# Altium project B5PLMF_ONLAB.PrjPCB
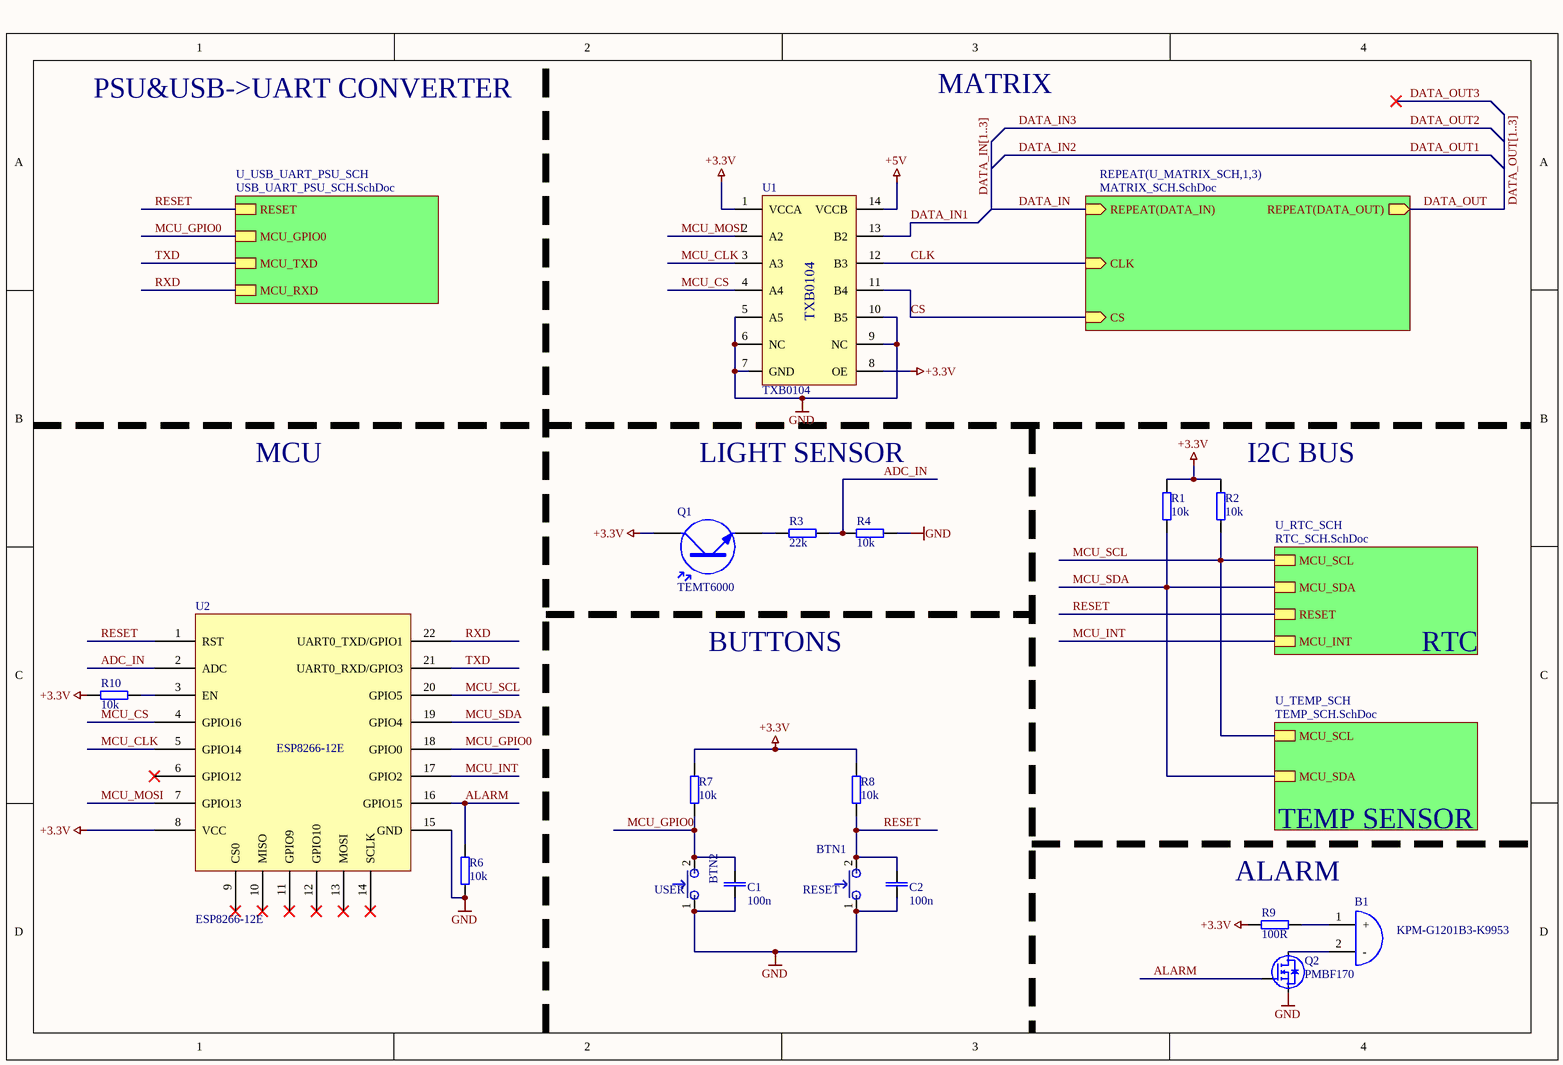
[diagram p0: MAIN_SCH.SchDoc]
5 sheets, 64 parts. Net scope: hierarchical (ports join the sheet entries above them; power ports are global).
Board file: B5PLMF_ONLAB.PcbDoc
Sheets:
  MAIN_SCH.SchDoc
    U_MATRIX_SCH1 = MATRIX_SCH.SchDoc
    U_MATRIX_SCH2 = MATRIX_SCH.SchDoc
    U_MATRIX_SCH3 = MATRIX_SCH.SchDoc
    U_RTC_SCH = RTC_SCH.SchDoc
    U_TEMP_SCH = TEMP_SCH.SchDoc
    U_USB_UART_PSU_SCH = USB_UART_PSU_SCH.SchDoc

## Sheet MAIN_SCH.SchDoc
size A4

### Parts
B1  KPM-G1201B3-K9953  [KPM-G1201B3-K9953]
BTN1  USER  [PBUTTON_SMD]
BTN2  RESET  [PBUTTON_SMD]
C1  100n  [CAP 0805]
C2  100n  [CAP 0805]
Q1  TEMT6000  [TEMT600]
Q2  PMBF170  [SOT23]
R1  10k  [RES 0805]
R2  10k  [RES 0805]
R3  22k  [RES 0805]
R4  10k  [RES 0805]
R6  10k  [RES 0805]
R7  10k  [RES 0805]
R8  10k  [RES 0805]
R9  100R  [RES 0805]
R10  10k  [RES 0805]
U1  TXB0104  [SO14]
U2  ESP8266-12E  [ESP8266-12E]

### Sub-sheets
REPEAT(U_MATRIX_SCH,1,3) = MATRIX_SCH.SchDoc: REPEAT(DATA_IN) (in), CLK (in), CS (in), REPEAT(DATA_OUT) (out)
U_RTC_SCH = RTC_SCH.SchDoc: MCU_SDA, MCU_SCL, MCU_INT, RESET
U_TEMP_SCH = TEMP_SCH.SchDoc: MCU_SDA, MCU_SCL
U_USB_UART_PSU_SCH = USB_UART_PSU_SCH.SchDoc: MCU_RXD, MCU_TXD, RESET, MCU_GPIO0

### Nets
+3.3V: Q1.1(C) R1.2 R2.2 R7.2 R8.2 R9.1 R10.2 U1.1(VCCA) U1.8(OE) U2.8(VCC)
+5V: U1.14(VCCB)
GND: BTN1.1 BTN2.1 C1.1 C2.1 Q2.2(S) R4.2 R6.1 U1.5(A5) U1.6(NC) U1.7(GND) U1.9(NC) U1.10(B5) U2.15(GND)
ADC_IN: R3.2 R4.1 U2.2(ADC)
ALARM: Q2.1(G) R6.2 U2.16(GPIO15)
CLK: U1.12(B3) ; sheet REPEAT(U_MATRIX_SCH,1,3)/CLK
CS: U1.11(B4) ; sheet REPEAT(U_MATRIX_SCH,1,3)/CS
DATA_IN: sheet REPEAT(U_MATRIX_SCH,1,3)/REPEAT(DATA_IN)
DATA_IN1: U1.13(B2)
DATA_OUT: sheet REPEAT(U_MATRIX_SCH,1,3)/REPEAT(DATA_OUT)
MCU_CLK: U1.3(A3) U2.5(GPIO14)
MCU_CS: U1.4(A4) U2.4(GPIO16)
MCU_GPIO0: BTN2.2 C1.2 R7.1 U2.18(GPIO0) ; sheet U_USB_UART_PSU_SCH/MCU_GPIO0
MCU_INT: U2.17(GPIO2) ; sheet U_RTC_SCH/MCU_INT
MCU_MOSI: U1.2(A2) U2.7(GPIO13)
MCU_SCL: R2.1 U2.20(GPIO5) ; sheet U_RTC_SCH/MCU_SCL, sheet U_TEMP_SCH/MCU_SCL
MCU_SDA: R1.1 U2.19(GPIO4) ; sheet U_RTC_SCH/MCU_SDA, sheet U_TEMP_SCH/MCU_SDA
RESET: BTN1.2 C2.2 R8.1 U2.1(RST) ; sheet U_RTC_SCH/RESET, sheet U_USB_UART_PSU_SCH/RESET
RXD: U2.22(UART0_TXD/GPIO1) ; sheet U_USB_UART_PSU_SCH/MCU_RXD
TXD: U2.21(UART0_RXD/GPIO3) ; sheet U_USB_UART_PSU_SCH/MCU_TXD
NetB1_1: B1.1(+) R9.2
NetB1_2: B1.2(-) Q2.3(D)
NetQ1_2: Q1.2(E) R3.1
NetR10_1: R10.1 U2.3(EN)

Not connected (* = marked no-connect by the designer): U2 6(GPIO12)* 9(CS0)* 10(MISO)* 11(GPIO9)* 12(GPIO10)* 13(MOSI)* 14(SCLK)*

### Buses and harness runs
bus DATA_IN[1..3]
bus DATA_OUT[1..3]

### Notes on the sheet
- PSU&USB->UART CONVERTER
- MATRIX
- MCU
- LIGHT SENSOR
- (near R2) I2C BUS
- BUTTONS
- RTC
- TEMP SENSOR
- ALARM

### Library data of the parts
B1 = BUZZER: Supplier: Lomex; Reference: 46-02-70; VALUE: KPM-G1201B3-K9953
BTN1 BTN2 = PUSHBUTTON: Tactile push button; Reference: 45-05-43; Supplier: Lomex
  BTN1: VALUE: USER
  BTN2: VALUE: RESET
C1 C2 = CAP: NON POLARIZED CAPACITOR; VALUE: 100n; Reference: 82-10-76; Supplier: Lomex
Q1 = TEMT6000: Light sensor; Reference: *; Supplier: *; VALUE: TEMT6000
Q2 = PMBF170: N-Channel MOSFET; Reference: 86-01-96; VALUE: PMBF170; Supplier: Lomex
R1-R4 R6-R10 = RES: RESISTOR; Supplier: Lomex
  R1 R2 R4 R6-R8 R10: Reference: 81-10-99; VALUE: 10k
  R3: Reference: 81-11-03; VALUE: 22k
  R9: Reference: 81-30-00; VALUE: 100R
U1 = TXB0104: Voltage level shifter; Reference: 2539993; Supplier: Farnell; VALUE: TXB0104
U2 = ESP8266-12E: WiFi module; Reference: *; Supplier: *; VALUE: *

## Sheet MATRIX_SCH.SchDoc
size A4
Used 3 times, as channels U_MATRIX_SCH1, U_MATRIX_SCH2, U_MATRIX_SCH3. Parts and nets are listed once, with the designators drawn on the sheet.
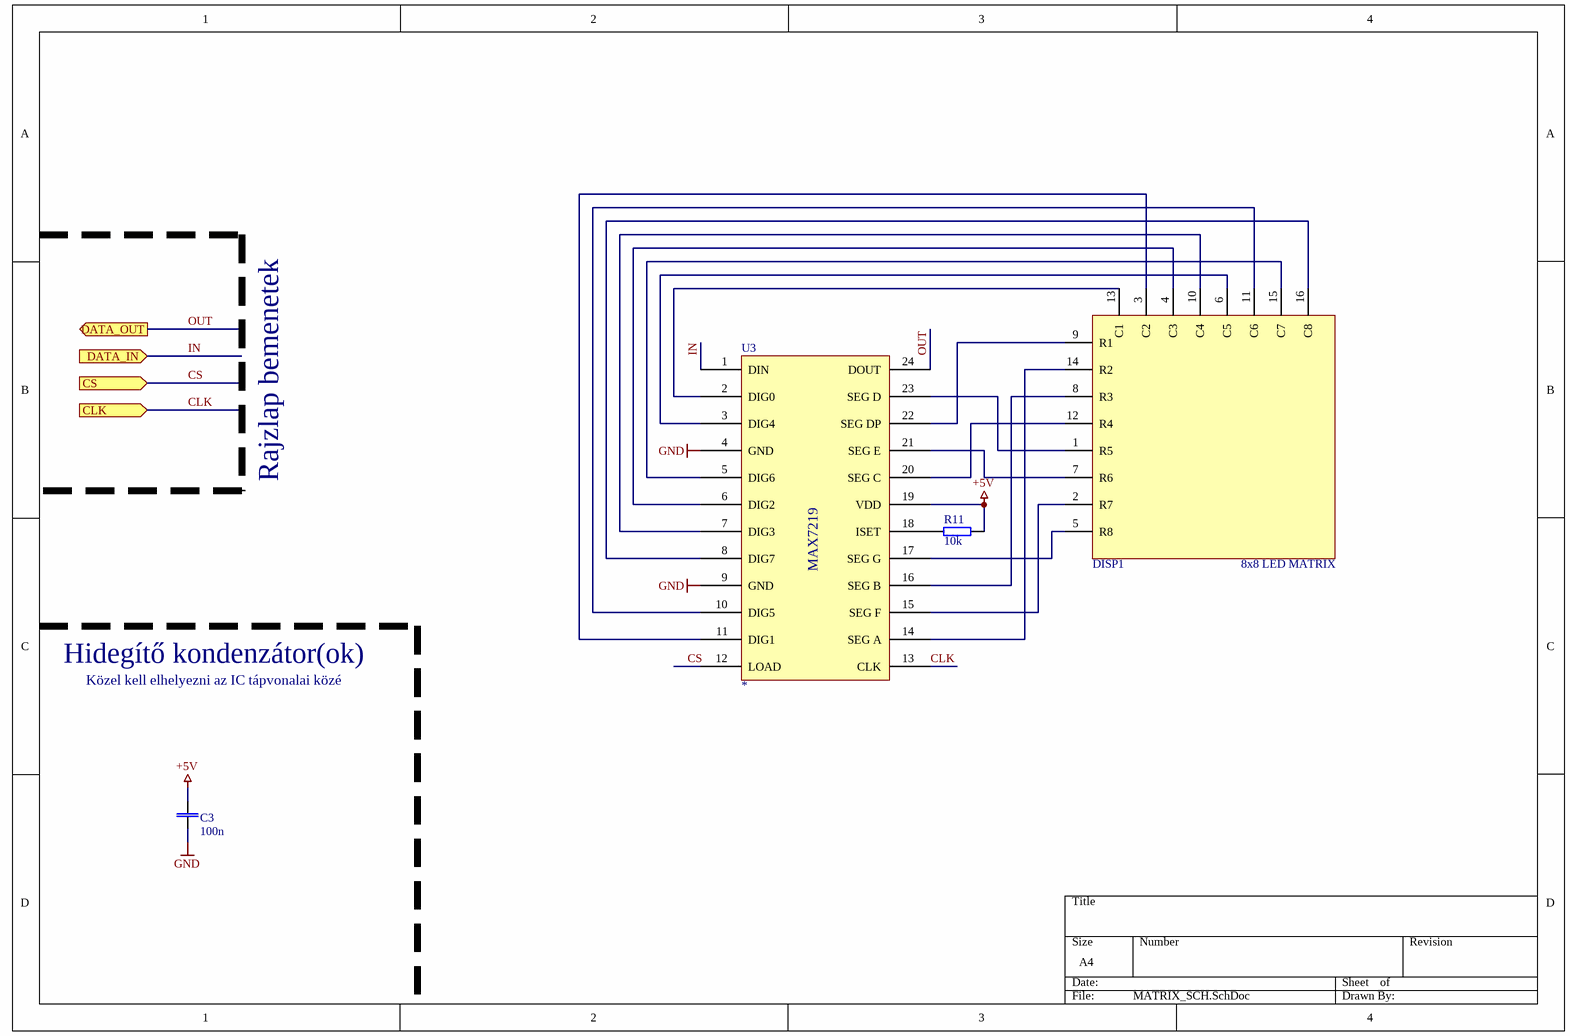
[diagram p1: MATRIX_SCH.SchDoc]

### Parts
C3  100n  [CAP 0805]
DISP1  8x8 LED MATRIX  [8x8_32mm_LED_MATRIX]
R11  10k  [RES 0805]
U3  *  [SO24]

### Ports
CLK (in), CS (in), DATA_IN (in), DATA_OUT (out)

### Nets
+5V: C3.2 R11.2 U3.19(VDD)
GND: C3.1 U3.4(GND) U3.9(GND)
CLK: U3.13(CLK) ; port CLK
CS: U3.12(LOAD) ; port CS
IN: U3.1(DIN) ; port DATA_IN
OUT: U3.24(DOUT) ; port DATA_OUT
NetDISP1_1: DISP1.1(R5) U3.23(SEG_D)
NetDISP1_2: DISP1.2(R7) U3.15(SEG_F)
NetDISP1_3: DISP1.3(C2) U3.11(DIG1)
NetDISP1_4: DISP1.4(C3) U3.6(DIG2)
NetDISP1_5: DISP1.5(R8) U3.17(SEG_G)
NetDISP1_6: DISP1.6(C5) U3.3(DIG4)
NetDISP1_7: DISP1.7(R6) U3.21(SEG_E)
NetDISP1_8: DISP1.8(R3) U3.16(SEG_B)
NetDISP1_9: DISP1.9(R1) U3.22(SEG_DP)
NetDISP1_10: DISP1.10(C4) U3.7(DIG3)
NetDISP1_11: DISP1.11(C6) U3.10(DIG5)
NetDISP1_12: DISP1.12(R4) U3.20(SEG_C)
NetDISP1_13: DISP1.13(C1) U3.2(DIG0)
NetDISP1_14: DISP1.14(R2) U3.14(SEG_A)
NetDISP1_15: DISP1.15(C7) U3.5(DIG6)
NetDISP1_16: DISP1.16(C8) U3.8(DIG7)
NetR11_1: R11.1 U3.18(ISET)

### Channels
U_MATRIX_SCH1: designators end in A; ports CLK=CLK CS=CS DATA_IN=DATA_IN1 DATA_OUT=DATA_IN2
U_MATRIX_SCH2: designators end in B; ports CLK=CLK CS=CS DATA_IN=DATA_IN2 DATA_OUT=DATA_IN3
U_MATRIX_SCH3: designators end in C; ports CLK=CLK CS=CS DATA_IN=DATA_IN3 DATA_OUT=DATA_OUT3

### Notes on the sheet
- Rajzlap bemenetek
- Hidegítő kondenzátor(ok)
- Közel kell elhelyezni az IC tápvonalai közé

### Library data of the parts
C3 = CAP: NON POLARIZED CAPACITOR; VALUE: 100n; Reference: 82-10-76; Supplier: Lomex
DISP1 = 8x8_LED_MATRIX: 8x8 LED Matrix display; Supplier: *; Reference: *; VALUE: 8x8 LED MATRIX
R11 = RES: RESISTOR; Reference: 81-10-99; Supplier: Lomex; VALUE: 10k
U3 = MAX7219: 8X8 LED DRIVER IC; Reference: *; Supplier: *; VALUE: *

## Sheet RTC_SCH.SchDoc
size A4
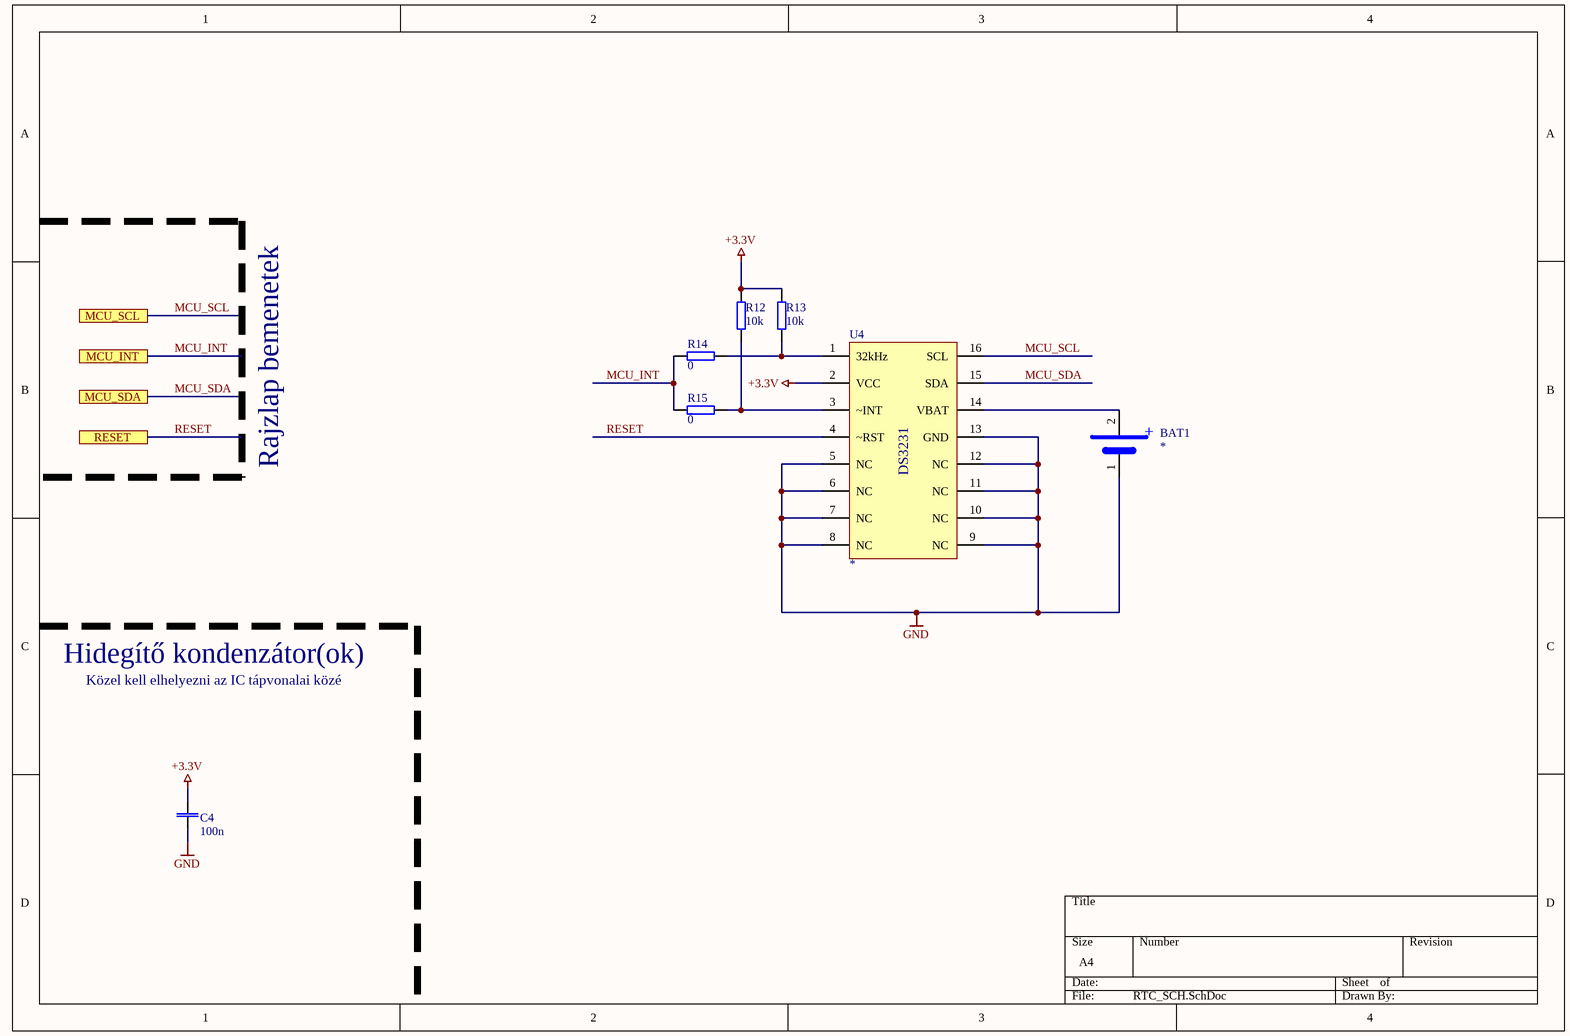
[diagram p2: RTC_SCH.SchDoc]

### Parts
BAT1  *  [CR2032]
C4  100n  [CAP 0805]
R12  10k  [RES 0805]
R13  10k  [RES 0805]
R14  0  [RES 0805]
R15  0  [RES 0805]
U4  *  [SO16W]

### Ports
MCU_INT, MCU_SCL, MCU_SDA, RESET

### Nets
+3.3V: C4.2 R12.2 R13.2 U4.2(VCC)
GND: BAT1.1 C4.1 U4.5(NC) U4.6(NC) U4.7(NC) U4.8(NC) U4.9(NC) U4.10(NC) U4.11(NC) U4.12(NC) U4.13(GND)
MCU_INT: R14.2 R15.2 ; port MCU_INT
MCU_SCL: U4.16(SCL) ; port MCU_SCL
MCU_SDA: U4.15(SDA) ; port MCU_SDA
RESET: U4.4(~RST) ; port RESET
NetBAT1_2: BAT1.2 U4.14(VBAT)
NetR12_1: R12.1 R15.1 U4.3(~INT)
NetR13_1: R13.1 R14.1 U4.1(32kHz)

### Notes on the sheet
- Rajzlap bemenetek
- Hidegítő kondenzátor(ok)
- Közel kell elhelyezni az IC tápvonalai közé
- (in symbol Battery) +

### Library data of the parts
BAT1 = Battery: VALUE: *; Supplier: *; Reference: *
C4 = CAP: NON POLARIZED CAPACITOR; VALUE: 100n; Reference: 82-10-76; Supplier: Lomex
R12-R15 = RES: RESISTOR; Supplier: Lomex
  R12 R13: Reference: 81-10-99; VALUE: 10k
  R14 R15: Reference: 81-10-02; VALUE: 0
U4 = DS3231: 3.3V Real Time Clock IC; Supplier: *; Reference: *; VALUE: *

## Sheet TEMP_SCH.SchDoc
size A4
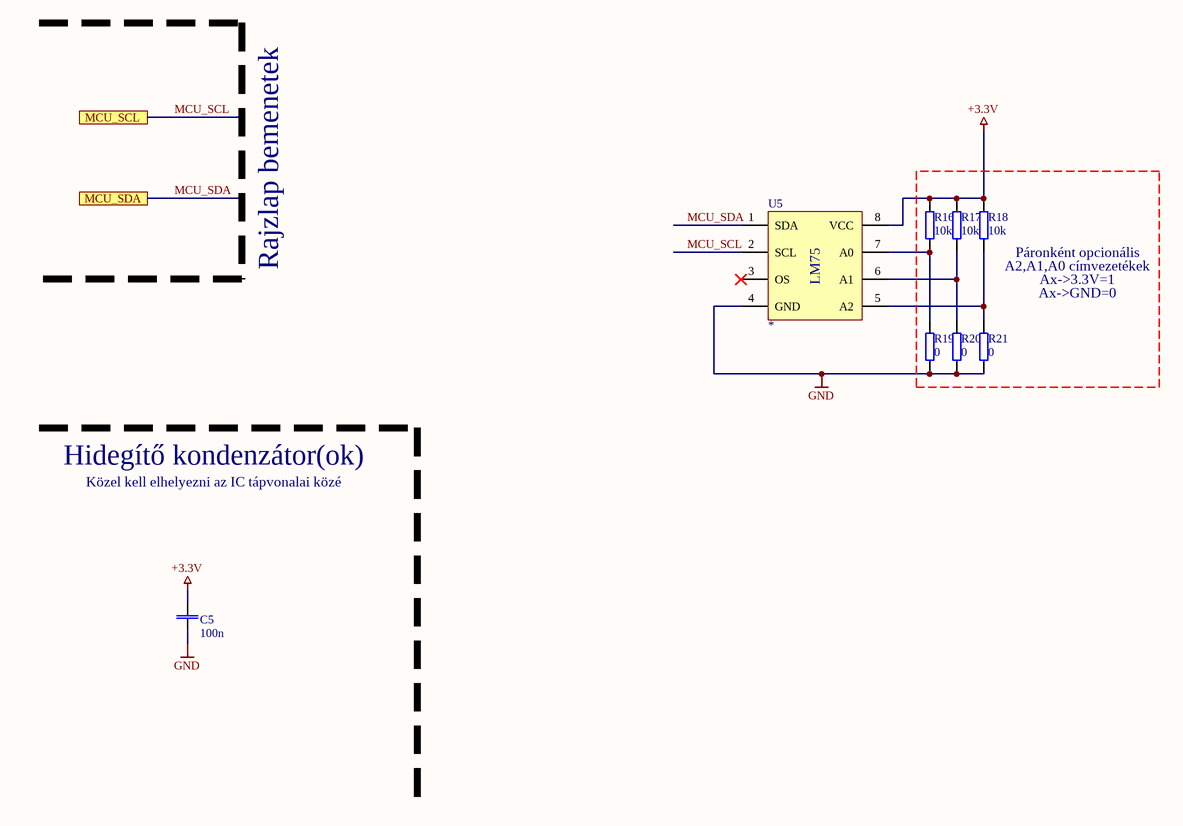
[diagram p3: TEMP_SCH.SchDoc]

### Parts
C5  100n  [CAP 0805]
R16  10k  [RES 0805]
R17  10k  [RES 0805]
R18  10k  [RES 0805]
R19  0  [RES 0805]
R20  0  [RES 0805]
R21  0  [RES 0805]
U5  *  [SO8]

### Ports
MCU_SCL, MCU_SDA

### Nets
+3.3V: C5.2 R16.2 R17.2 R18.2 U5.8(VCC)
GND: C5.1 R19.1 R20.1 R21.1 U5.4(GND)
MCU_SCL: U5.2(SCL) ; port MCU_SCL
MCU_SDA: U5.1(SDA) ; port MCU_SDA
NetR16_1: R16.1 R19.2 U5.7(A0)
NetR17_1: R17.1 R20.2 U5.6(A1)
NetR18_1: R18.1 R21.2 U5.5(A2)

Not connected (* = marked no-connect by the designer): U5 3(OS)*

### Notes on the sheet
- Rajzlap bemenetek
- (near R18) Páronként opcionális
- (near R18) A2,A1,A0 címvezetékek
- Ax->3.3V=1
- Ax->GND=0
- Hidegítő kondenzátor(ok)
- Közel kell elhelyezni az IC tápvonalai közé

### Library data of the parts
C5 = CAP: NON POLARIZED CAPACITOR; VALUE: 100n; Reference: 82-10-76; Supplier: Lomex
R16-R21 = RES: RESISTOR; Supplier: Lomex
  R16-R18: Reference: 81-10-99; VALUE: 10k
  R19-R21: Reference: 81-10-02; VALUE: 0
U5 = LM75: Temperature sensor with I2C interface; Supplier: *; Reference: *; VALUE: *

## Sheet USB_UART_PSU_SCH.SchDoc
size A4
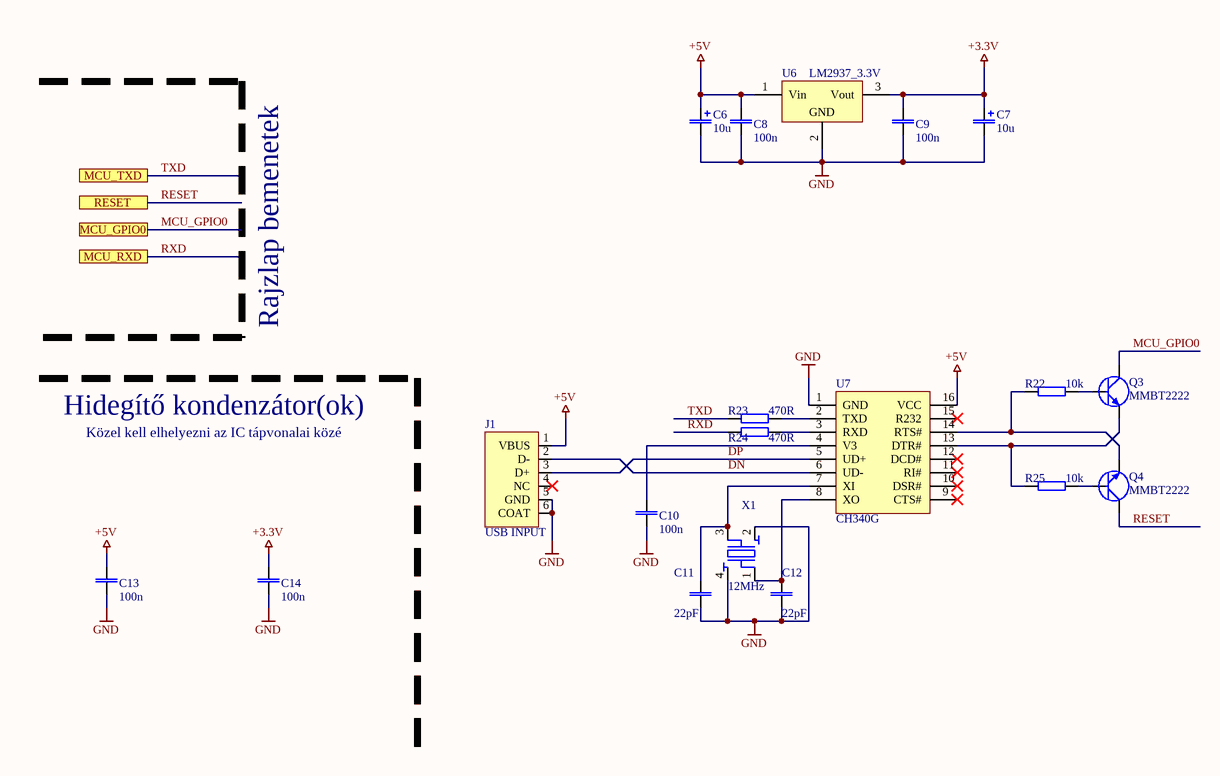
[diagram p4: USB_UART_PSU_SCH.SchDoc]

### Parts
C6  10u  [CAP 1210]
C7  10u  [CAP 1210]
C8  100n  [CAP 0805]
C9  100n  [CAP 0805]
C10  100n  [CAP 0805]
C11  22pF  [CAP 0805]
C12  22pF  [CAP 0805]
C13  100n  [CAP 0805]
C14  100n  [CAP 0805]
J1  USB INPUT  [MUSB-B2.0S05PFHSB-T]
Q3  MMBT2222  [SOT23]
Q4  MMBT2222  [SOT23]
R22  10k  [RES 0805]
R23  470R  [RES 0805]
R24  470R  [RES 0805]
R25  10k  [RES 0805]
U6  LM2937_3.3V  [SOT223]
U7  CH340G  [SO16]
X1  12MHz  [SMD_QUARTZ]

### Ports
MCU_GPIO0, MCU_RXD, MCU_TXD, RESET

### Nets
+3.3V: C7.1(+) C9.2 C14.2 U6.3(Vout)
+5V: C6.1(+) C8.2 C13.2 J1.1(VBUS) U6.1(Vin) U7.16(VCC)
GND: C6.2(-) C7.2(-) C8.1 C9.1 C10.2 C11.2 C12.2 C13.1 C14.1 J1.5(GND) J1.6(COAT) U6.2(GND) U7.1(GND) X1.2(GND) X1.4(GND)
DN: J1.2(D-) U7.6(UD-)
DP: J1.3(D+) U7.5(UD+)
MCU_GPIO0: Q3.3(C) ; port MCU_GPIO0
RESET: Q4.3(C) ; port RESET
RXD: R24.1 ; port MCU_RXD
TXD: R23.1 ; port MCU_TXD
NetC10_1: C10.1 U7.4(V3)
NetC11_1: C11.1 U7.7(XI) X1.3
NetC12_1: C12.1 U7.8(XO) X1.1
NetQ3_1: Q3.1(B) R22.2
NetQ3_2: Q3.2(E) R25.1 U7.13(DTR#)
NetQ4_1: Q4.1(B) R25.2
NetQ4_2: Q4.2(E) R22.1 U7.14(RTS#)
NetR23_2: R23.2 U7.2(TXD)
NetR24_2: R24.2 U7.3(RXD)

Not connected (* = marked no-connect by the designer): J1 4(NC)*; U7 9(CTS#)* 10(DSR#)* 11(RI#)* 12(DCD#)* 15(R232)*

### Notes on the sheet
- Rajzlap bemenetek
- Hidegítő kondenzátor(ok)
- Közel kell elhelyezni az IC tápvonalai közé

### Library data of the parts
C6 C7 = CAP_POL: POLARIZED CAPACITOR; Reference: 92-01-83; Supplier: Lomex; VALUE: 10u
C8-C14 = CAP: NON POLARIZED CAPACITOR; Supplier: Lomex
  C8-C10 C13 C14: VALUE: 100n; Reference: 82-10-76
  C11 C12: VALUE: 22pF; Reference: 82-09-18
J1 = USB_5PIN: 5PIN miniUSB SMD connector; Supplier: Lomex; Reference: 43-28-33; VALUE: USB INPUT
Q3 Q4 = MMBT2222: NPN transistor, SO23; Value: MMBT2222; Supplier: Lomex; Reference: 86-00-73
R22-R25 = RES: RESISTOR; Supplier: Lomex
  R22 R25: Reference: 81-10-99; VALUE: 10k
  R23 R24: Reference: 81-10-83; VALUE: 470R
U6 = LM2937: SOT223; Reference: *; Supplier: *; VALUE: LM2937_3.3V
U7 = CH340G: USB to UART; Reference: *; VALUE: CH340G; Supplier: *
X1 = QUARTZ: QUARTZ CRYSTAL; VALUE: 12MHz; Supplier: Lomex; Reference: 40-02-17

## Nets that join several sheets
+3.3V: MAIN_SCH (10 pins), RTC_SCH (C4.2 R12.2 R13.2 U4.2), TEMP_SCH (5 pins), USB_UART_PSU_SCH (C7.1 C9.2 C14.2 U6.3)
+5V: MAIN_SCH (U1.14), U_MATRIX_SCH1 (C3A.2 R11A.2 U3A.19), U_MATRIX_SCH2 (C3B.2 R11B.2 U3B.19), U_MATRIX_SCH3 (C3C.2 R11C.2 U3C.19), USB_UART_PSU_SCH (6 pins)
GND: MAIN_SCH (13 pins), U_MATRIX_SCH1 (C3A.1 U3A.4 U3A.9), U_MATRIX_SCH2 (C3B.1 U3B.4 U3B.9), U_MATRIX_SCH3 (C3C.1 U3C.4 U3C.9), RTC_SCH (11 pins), TEMP_SCH (5 pins), USB_UART_PSU_SCH (15 pins)
CLK: MAIN_SCH (U1.12), U_MATRIX_SCH1 (U3A.13), U_MATRIX_SCH2 (U3B.13), U_MATRIX_SCH3 (U3C.13)
CS: MAIN_SCH (U1.11), U_MATRIX_SCH1 (U3A.12), U_MATRIX_SCH2 (U3B.12), U_MATRIX_SCH3 (U3C.12)
DATA_IN1: MAIN_SCH (U1.13), U_MATRIX_SCH1 (U3A.1)
DATA_IN2: U_MATRIX_SCH1 (U3A.24), U_MATRIX_SCH2 (U3B.1)
DATA_IN3: U_MATRIX_SCH2 (U3B.24), U_MATRIX_SCH3 (U3C.1)
MCU_GPIO0: MAIN_SCH (BTN2.2 C1.2 R7.1 U2.18), USB_UART_PSU_SCH (Q3.3)
MCU_INT: MAIN_SCH (U2.17), RTC_SCH (R14.2 R15.2)
MCU_SCL: MAIN_SCH (R2.1 U2.20), RTC_SCH (U4.16), TEMP_SCH (U5.2)
MCU_SDA: MAIN_SCH (R1.1 U2.19), RTC_SCH (U4.15), TEMP_SCH (U5.1)
RESET: MAIN_SCH (BTN1.2 C2.2 R8.1 U2.1), RTC_SCH (U4.4), USB_UART_PSU_SCH (Q4.3)
RXD: MAIN_SCH (U2.22), USB_UART_PSU_SCH (R24.1)
TXD: MAIN_SCH (U2.21), USB_UART_PSU_SCH (R23.1)